# Altium schematic sheet DC_DC_15V.SchDoc
size A4
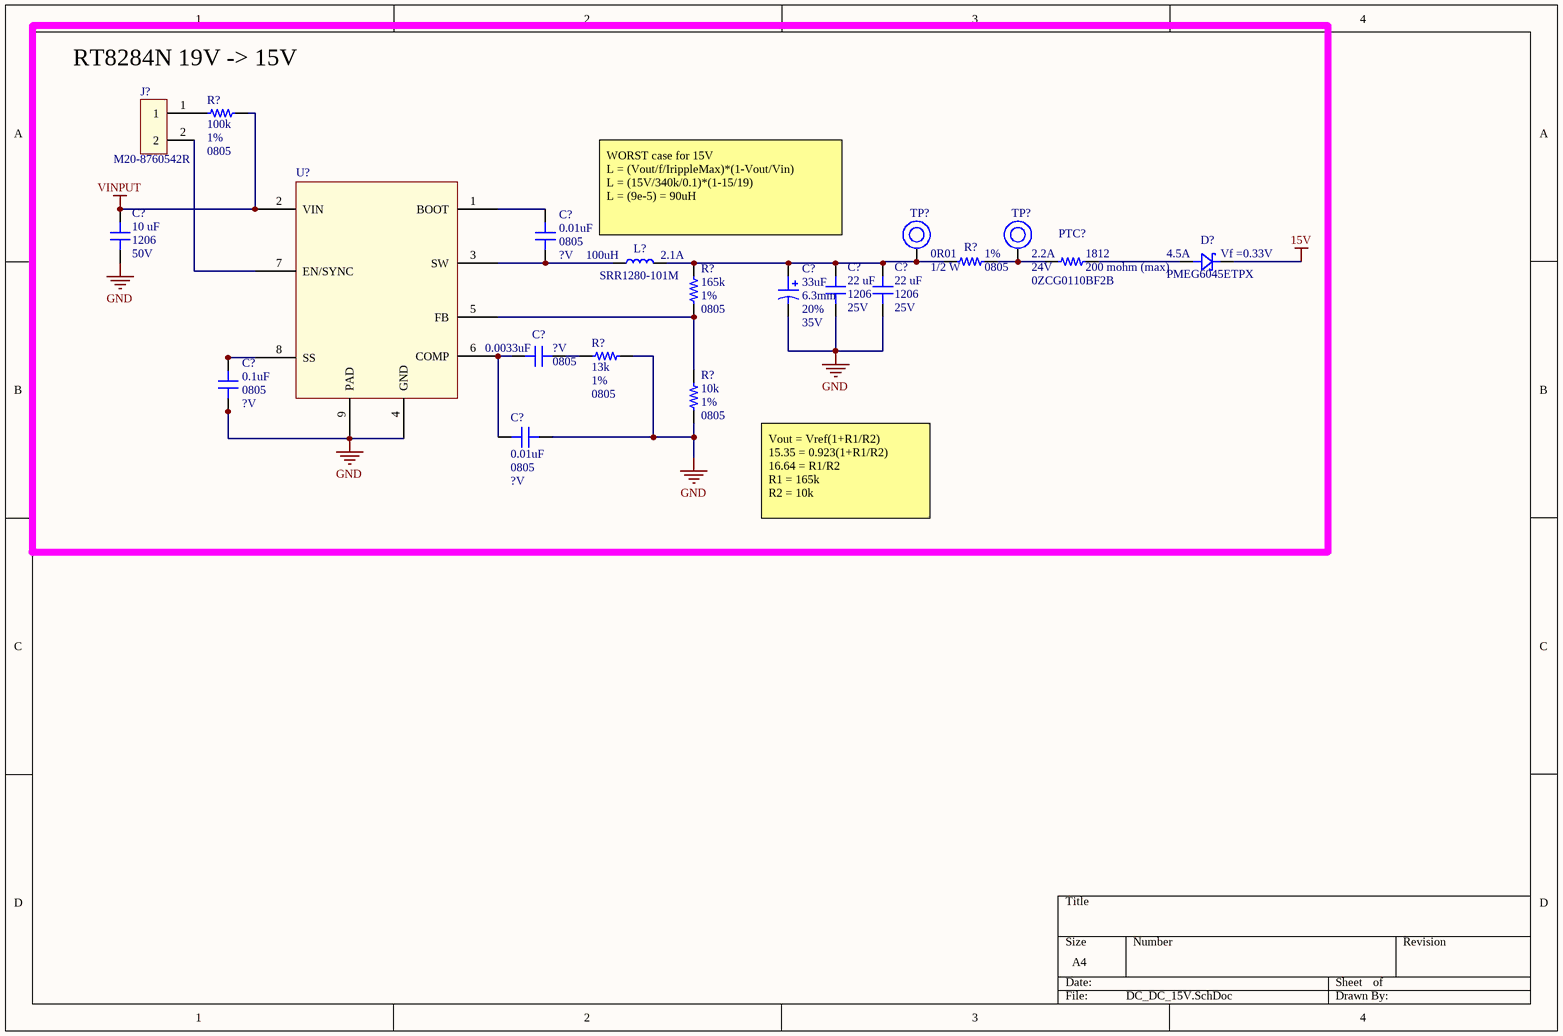
[diagram p0: DC_DC_15V.SchDoc]

## Parts
(Parts that share a designator on the sheet are numbered #1, #2 ... from top to bottom, then left to right.)
C?#1  value 10 uF  Package: 1206  Voltage: 50V  [CAP_1206]  (hidden comment: CAP - 1206)
C?#2  value 0.01uF  Package: 0805  Voltage: ?V  [CAP_0805]  (hidden comment: CAP - 0805)
C?#3  value 33uF  Package: 6.3mm  Tolerance: 20%  Voltage: 35V  [CAP ALU - 6.3mm DIA]  (hidden comment: CAP ALU - 6.3mm)
C?#4  value 22 uF  Package: 1206  Voltage: 25V  [CAP_1206]  (hidden comment: CAP - 1206)
C?#5  value 22 uF  Package: 1206  Voltage: 25V  [CAP_1206]  (hidden comment: CAP - 1206)
C?#6  value 0.0033uF  Package: 0805  Voltage: ?V  [CAP_0805]  (hidden comment: CAP - 0805)
C?#7  value 0.1uF  Package: 0805  Voltage: ?V  [CAP_0805]  (hidden comment: CAP - 0805)
C?#8  value 0.01uF  Package: 0805  Voltage: ?V  [CAP_0805]  (hidden comment: CAP - 0805)
D?  Current: 4.5A  Vf: Vf =0.33V  Part number: PMEG6045ETPX  (hidden comment: SCHOTTKEY)
J?  Part number: M20-8760542R  [Jumper 2 pos SM]  (hidden comment: Header 2 pin SM)
L?  value 100uH  Current: 2.1A  Part number: SRR1280-101M  (hidden comment: IND)
PTC?  Trip value: 2.2A  Res: 200 mohm (max)  Voltage: 24V  Package: 1812  Part number: 0ZCG0110BF2B  [PTC - 1812]  (hidden comment: PTC - 1812)
R?#1  value 100k  Tolerance: 1%  Package: 0805  [FER_0805]  (hidden comment: RES - 0805)
R?#2  value 0R01  Watt: 1/2 W  Tolerance: 1%  Package: 0805  [FER_0805]  (hidden comment: RES - 0805)
R?#3  value 165k  Tolerance: 1%  Package: 0805  [FER_0805]  (hidden comment: RES - 0805)
R?#4  value 13k  Tolerance: 1%  Package: 0805  [FER_0805]  (hidden comment: RES - 0805)
R?#5  value 10k  Tolerance: 1%  Package: 0805  [FER_0805]  (hidden comment: RES - 0805)
TP?#1  TestPoint 3x3mm  [TestPoint 3X3mm]  (value not drawn)
TP?#2  TestPoint 3x3mm  [TestPoint 3X3mm]  (value not drawn)
U?  RT8284N  (value not drawn)

## Blocks framed on the sheet
RT8284N 19V -> 15V: C?#1-C?#8 D? J? L? PTC? R?#1-R?#5 TP?#1 TP?#2 U?

## Nets
15V: D?.2
GND: C?#1.2 C?#3.2 C?#4.2 C?#5.2 C?#7.2 C?#8.2 R?#4.2 R?#5.2 U?.4(GND) U?.9(PAD)
VINPUT: C?#1.1 R?#1.2 U?.2(VIN)
NetC?#2_1: C?#2.1 U?.1(BOOT)
NetC?#2_2: C?#2.2 L?.1 U?.3(SW)
NetC?#3_1: C?#3.1 C?#4.1 C?#5.1 L?.2 R?#2.1 R?#3.1 TP?#1.1
NetC?#6_1: C?#6.1 C?#8.1 U?.6(COMP)
NetC?#6_2: C?#6.2 R?#4.1
NetC?#7_1: C?#7.1 U?.8(SS)
NetD?_1: D?.1 PTC?.2
NetJ?_1: J?.1 R?#1.1
NetJ?_2: J?.2 U?.7(EN/SYNC)
NetPTC?_1: PTC?.1 R?#2.2 TP?#2.1
NetR?#3_2: R?#3.2 R?#5.1 U?.5(FB)

## Notes on the sheet
- WORST case for 15V
  L = (Vout/f/IrippleMax)*(1-Vout/Vin)
  L = (15V/340k/0.1)*(1-15/19)
  L = (9e-5) = 90uH
- Vout = Vref(1+R1/R2)
  15.35 = 0.923(1+R1/R2)
  16.64 = R1/R2
  R1 = 165k
  R2 = 10k

## Library data of the parts
C?#1 = CAP - 1206: Part number: GRT31CR61H106ME01L
C?#2 C?#8 = CAP - 0805: Part number: CL21B103KBANNNC
C?#3 = CAP ALU - 6_3mm: Part number: EEE-FK1V330P
C?#4 C?#5 = CAP - 1206: Part number: CL31A226KAHNNNE
C?#6 = CAP - 0805: Part number: CL21B332KBANNNC
C?#7 = CAP - 0805: Part number: CC0805KRX7R9BB104
R?#1 = RES - 0805: Part number: RMCF0805FT100K; Watt: ? W
R?#2 = RES - 0805: Part number: KRL1220E-M-R010-F-T5
R?#3 = RES - 0805: Part number: RC0805FR-07165KL; Watt: ? W
R?#4 = RES - 0805: Part number: RC0805FR-0713KL; Watt: ? W
R?#5 = RES - 0805: Part number: RMCF0805FT10K0; Watt: ? W
L? = IND: Package: ?
U? = RT8284N: Part number: RT8284N